# Altium project PowerBoard.PrjPcb (part 2 of 2)
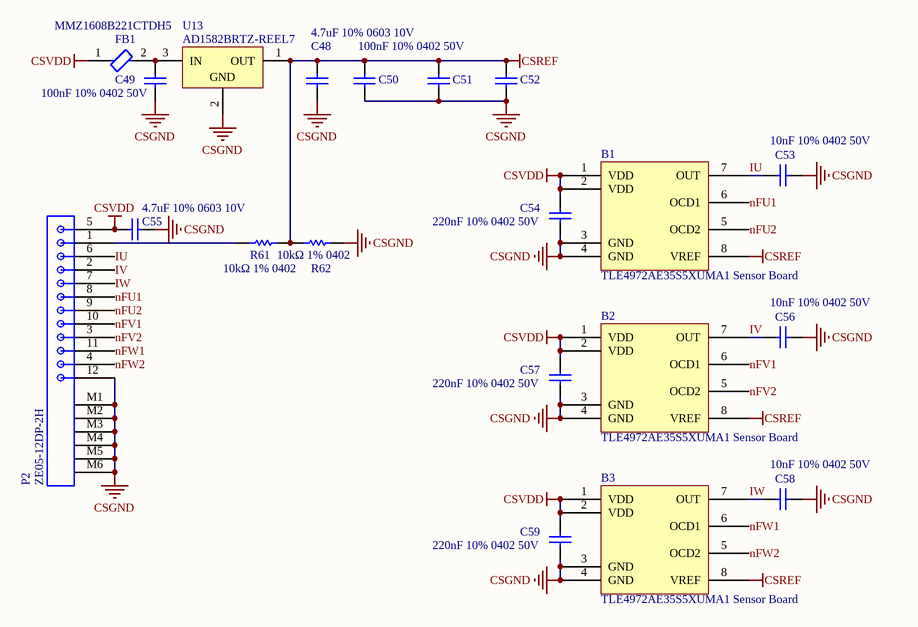
[diagram p14: CurrentSense.SchDoc]

## Nets that join several sheets
+3V3: ControlBoardConnector (8 pins), PowerBridge (R1.1), PBD/HBU/DRVH (C5_PBD_HBU_DRVH.2 U1_PBD_HBU_DRVH.9), PBD/HBU/DRVL (C5_PBD_HBU_DRVL.2 U1_PBD_HBU_DRVL.9), PBD/HBW/DRVH (C5_PBD_HBW_DRVH.2 U1_PBD_HBW_DRVH.9), PBD/HBW/DRVL (C5_PBD_HBW_DRVL.2 U1_PBD_HBW_DRVL.9), IoExpander (6 pins), SpiMux (C24.2 U5.6 U5.16), TempAdc (C25.2 U6.8), PBD/TAD/IS1 (C21_IS1.2 U3_IS1.3), PBD/TAD/IS2 (C21_IS2.2 U3_IS2.3), PBD/TAD/IS3 (C21_IS3.2 U3_IS3.3), PBD/TAD/IS4 (C21_IS4.2 U3_IS4.3), DcLink (5 pins), AndGate (C41.1 U9.5), PBD/HBV/DRVH (C5_PBD_HBV_DRVH.2 U1_PBD_HBV_DRVH.9), PBD/HBV/DRVL (C5_PBD_HBV_DRVL.2 U1_PBD_HBV_DRVL.9), Rectifier (C44.2 R46.1 U10.3)
+24V: ControlBoardConnector (8 pins), PBD/HBU/DRVH/ISU (C15_PBD_HBU_DRVH_ISU.2 C16_PBD_HBU_DRVH_ISU.2 U2_PBD_HBU_DRVH_ISU.6 U2_PBD_HBU_DRVH_ISU.7), PBD/HBU/DRVL/ISU (C15_PBD_HBU_DRVL_ISU.2 C16_PBD_HBU_DRVL_ISU.2 U2_PBD_HBU_DRVL_ISU.6 U2_PBD_HBU_DRVL_ISU.7), PBD/HBW/DRVH/ISU (C15_PBD_HBW_DRVH_ISU.2 C16_PBD_HBW_DRVH_ISU.2 U2_PBD_HBW_DRVH_ISU.6 U2_PBD_HBW_DRVH_ISU.7), PBD/HBW/DRVL/ISU (C15_PBD_HBW_DRVL_ISU.2 C16_PBD_HBW_DRVL_ISU.2 U2_PBD_HBW_DRVL_ISU.6 U2_PBD_HBW_DRVL_ISU.7), PBD/HBV/DRVH/ISU (C15_PBD_HBV_DRVH_ISU.2 C16_PBD_HBV_DRVH_ISU.2 U2_PBD_HBV_DRVH_ISU.6 U2_PBD_HBV_DRVH_ISU.7), PBD/HBV/DRVL/ISU (C15_PBD_HBV_DRVL_ISU.2 C16_PBD_HBV_DRVL_ISU.2 U2_PBD_HBV_DRVL_ISU.6 U2_PBD_HBV_DRVL_ISU.7)
GND: ControlBoardConnector (24 pins), PowerBridge (R2.2 T1.T2 T1.T4 T1.T6), PBD/HBU/DRVH (C5_PBD_HBU_DRVH.1 C6_PBD_HBU_DRVH.1 U1_PBD_HBU_DRVH.1 U1_PBD_HBU_DRVH.18), PBD/HBU/DRVH/ISU (16 pins), PBD/HBU/DRVL (C5_PBD_HBU_DRVL.1 C6_PBD_HBU_DRVL.1 U1_PBD_HBU_DRVL.1 U1_PBD_HBU_DRVL.18), PBD/HBU/DRVL/ISU (16 pins), PBD/HBW/DRVH (C5_PBD_HBW_DRVH.1 C6_PBD_HBW_DRVH.1 U1_PBD_HBW_DRVH.1 U1_PBD_HBW_DRVH.18), PBD/HBW/DRVH/ISU (16 pins), PBD/HBW/DRVL (C5_PBD_HBW_DRVL.1 C6_PBD_HBW_DRVL.1 U1_PBD_HBW_DRVL.1 U1_PBD_HBW_DRVL.18), PBD/HBW/DRVL/ISU (16 pins), IoExpander (C23.1 Q1.2 U4.9 U4.EP), SpiMux (C24.1 U5.8 U5.17), TempAdc (C25.1 U6.3), PBD/TAD/IS1 (5 pins), PBD/TAD/IS2 (5 pins), PBD/TAD/IS3 (5 pins), PBD/TAD/IS4 (5 pins), DcLink (7 pins), AndGate (C41.2 R43.2 R44.2 U9.3), PBD/HBV/DRVH (C5_PBD_HBV_DRVH.1 C6_PBD_HBV_DRVH.1 U1_PBD_HBV_DRVH.1 U1_PBD_HBV_DRVH.18), PBD/HBV/DRVH/ISU (16 pins), PBD/HBV/DRVL (C5_PBD_HBV_DRVL.1 C6_PBD_HBV_DRVL.1 U1_PBD_HBV_DRVL.1 U1_PBD_HBV_DRVL.18), PBD/HBV/DRVL/ISU (16 pins), Rectifier (C44.1 R52.1 U10.4)
N: PowerBridge (T1.N1 T1.N2 T1.N3), DcLink (23 pins), Rectifier (Q5.4)
P: PowerBridge (T1.P1 T1.P2 T1.P3), DcLink (15 pins), Rectifier (6 pins)
BRIDGE_ENA: PowerBridge (BENA.1), PBD/HBU/DRVH/ISU (U2_PBD_HBU_DRVH_ISU.4), PBD/HBU/DRVL/ISU (U2_PBD_HBU_DRVL_ISU.4), PBD/HBW/DRVH/ISU (U2_PBD_HBW_DRVH_ISU.4), PBD/HBW/DRVL/ISU (U2_PBD_HBW_DRVL_ISU.4), AndGate (U9.4), PBD/HBV/DRVH/ISU (U2_PBD_HBV_DRVH_ISU.4), PBD/HBV/DRVL/ISU (U2_PBD_HBV_DRVL_ISU.4)
CTRL_ENA: ControlBoardConnector (P1.9), PowerBridge (CENA.1), AndGate (R43.1 U9.1)
CTRL_nPG: ControlBoardConnector (P1.10), PowerBridge (CPG.1 R1.2), PBD/HBU/DRVH/ISU (U2_PBD_HBU_DRVH_ISU.3), PBD/HBU/DRVL/ISU (U2_PBD_HBU_DRVL_ISU.3), PBD/HBW/DRVH/ISU (U2_PBD_HBW_DRVH_ISU.3), PBD/HBW/DRVL/ISU (U2_PBD_HBW_DRVL_ISU.3), PBD/HBV/DRVH/ISU (U2_PBD_HBV_DRVH_ISU.3), PBD/HBV/DRVL/ISU (U2_PBD_HBV_DRVL_ISU.3)
DRV_COM: PowerBridge (T1.S2.1 T1.S2.2), PBD/HBU/DRVL (11 pins), PBD/HBU/DRVL/ISU (5 pins)
DRV_COM: PowerBridge (T1.S1), PBD/HBU (PHS_HBU.1), PBD/HBU/DRVH (11 pins), PBD/HBU/DRVH/ISU (5 pins)
DRV_COM: PowerBridge (T1.S4.1 T1.S4.2), PBD/HBV/DRVL (11 pins), PBD/HBV/DRVL/ISU (5 pins)
DRV_COM: PowerBridge (T1.S3), PBD/HBV (PHS_HBV.1), PBD/HBV/DRVH (11 pins), PBD/HBV/DRVH/ISU (5 pins)
DRV_COM: PowerBridge (T1.S6.1 T1.S6.2), PBD/HBW/DRVL (11 pins), PBD/HBW/DRVL/ISU (5 pins)
DRV_COM: PowerBridge (T1.S5), PBD/HBW (PHS_HBW.1), PBD/HBW/DRVH (11 pins), PBD/HBW/DRVH/ISU (5 pins)
DRV_VDD_DRVH: PBD/HBU/DRVH (C9_PBD_HBU_DRVH.1 C10_PBD_HBU_DRVH.1 U1_PBD_HBU_DRVH.35), PBD/HBU/DRVH/ISU (6 pins)
DRV_VDD_DRVH: PBD/HBW/DRVH (C9_PBD_HBW_DRVH.1 C10_PBD_HBW_DRVH.1 U1_PBD_HBW_DRVH.35), PBD/HBW/DRVH/ISU (6 pins)
DRV_VDD_DRVH: PBD/HBV/DRVH (C9_PBD_HBV_DRVH.1 C10_PBD_HBV_DRVH.1 U1_PBD_HBV_DRVH.35), PBD/HBV/DRVH/ISU (6 pins)
DRV_VDD_DRVL: PBD/HBU/DRVL (C9_PBD_HBU_DRVL.1 C10_PBD_HBU_DRVL.1 U1_PBD_HBU_DRVL.35), PBD/HBU/DRVL/ISU (6 pins)
DRV_VDD_DRVL: PBD/HBW/DRVL (C9_PBD_HBW_DRVL.1 C10_PBD_HBW_DRVL.1 U1_PBD_HBW_DRVL.35), PBD/HBW/DRVL/ISU (6 pins)
DRV_VDD_DRVL: PBD/HBV/DRVL (C9_PBD_HBV_DRVL.1 C10_PBD_HBV_DRVL.1 U1_PBD_HBV_DRVL.35), PBD/HBV/DRVL/ISU (6 pins)
DRV_VEE_DRVH: PBD/HBU/DRVH (C11_PBD_HBU_DRVH.2 C12_PBD_HBU_DRVH.2 U1_PBD_HBU_DRVH.19 U1_PBD_HBU_DRVH.30), PBD/HBU/DRVH/ISU (20 pins)
DRV_VEE_DRVH: PBD/HBW/DRVH (C11_PBD_HBW_DRVH.2 C12_PBD_HBW_DRVH.2 U1_PBD_HBW_DRVH.19 U1_PBD_HBW_DRVH.30), PBD/HBW/DRVH/ISU (20 pins)
DRV_VEE_DRVH: PBD/HBV/DRVH (C11_PBD_HBV_DRVH.2 C12_PBD_HBV_DRVH.2 U1_PBD_HBV_DRVH.19 U1_PBD_HBV_DRVH.30), PBD/HBV/DRVH/ISU (20 pins)
DRV_VEE_DRVL: PBD/HBU/DRVL (C11_PBD_HBU_DRVL.2 C12_PBD_HBU_DRVL.2 U1_PBD_HBU_DRVL.19 U1_PBD_HBU_DRVL.30), PBD/HBU/DRVL/ISU (20 pins)
DRV_VEE_DRVL: PBD/HBW/DRVL (C11_PBD_HBW_DRVL.2 C12_PBD_HBW_DRVL.2 U1_PBD_HBW_DRVL.19 U1_PBD_HBW_DRVL.30), PBD/HBW/DRVL/ISU (20 pins)
DRV_VEE_DRVL: PBD/HBV/DRVL (C11_PBD_HBV_DRVL.2 C12_PBD_HBV_DRVL.2 U1_PBD_HBV_DRVL.19 U1_PBD_HBV_DRVL.30), PBD/HBV/DRVL/ISU (20 pins)
NetC22_IS1_2: TempAdc (U6.4), PBD/TAD/IS1 (C22_IS1.2 R17_IS1.2 TMPA_IS1.1)
NetC22_IS2_2: TempAdc (U6.5), PBD/TAD/IS2 (C22_IS2.2 R17_IS2.2 TMPA_IS2.1)
NetC22_IS3_2: TempAdc (U6.6), PBD/TAD/IS3 (C22_IS3.2 R17_IS3.2 TMPA_IS3.1)
NetC22_IS4_2: TempAdc (U6.7), PBD/TAD/IS4 (C22_IS4.2 R17_IS4.2 TMPA_IS4.1)
NetC36_1: ControlBoardConnector (P1.48), DcLink (C36.1 R27.1)
NetC36_2: ControlBoardConnector (P1.49), DcLink (C36.2 R30.1)
NetD1_PBD_HBU_DRVH_1: PowerBridge (T1.D1.1), PBD/HBU/DRVH (D1_PBD_HBU_DRVH.1 D2_PBD_HBU_DRVH.1)
NetD1_PBD_HBU_DRVL_1: PowerBridge (T1.D2), PBD/HBU/DRVL (D1_PBD_HBU_DRVL.1 D2_PBD_HBU_DRVL.1)
NetD1_PBD_HBV_DRVH_1: PowerBridge (T1.D3.1), PBD/HBV/DRVH (D1_PBD_HBV_DRVH.1 D2_PBD_HBV_DRVH.1)
NetD1_PBD_HBV_DRVL_1: PowerBridge (T1.D4), PBD/HBV/DRVL (D1_PBD_HBV_DRVL.1 D2_PBD_HBV_DRVL.1)
NetD1_PBD_HBW_DRVH_1: PowerBridge (T1.D5.1), PBD/HBW/DRVH (D1_PBD_HBW_DRVH.1 D2_PBD_HBW_DRVH.1)
NetD1_PBD_HBW_DRVL_1: PowerBridge (T1.D6), PBD/HBW/DRVL (D1_PBD_HBW_DRVL.1 D2_PBD_HBW_DRVL.1)
NetD3_PBD_HBU_DRVH_1: PowerBridge (T1.G1), PBD/HBU (HGAT_HBU.1), PBD/HBU/DRVH (D3_PBD_HBU_DRVH.1 R8_PBD_HBU_DRVH.2 R10_PBD_HBU_DRVH.2 U1_PBD_HBU_DRVH.29)
NetD3_PBD_HBU_DRVL_1: PowerBridge (T1.G2), PBD/HBU (LGAT_HBU.1), PBD/HBU/DRVL (D3_PBD_HBU_DRVL.1 R8_PBD_HBU_DRVL.2 R10_PBD_HBU_DRVL.2 U1_PBD_HBU_DRVL.29)
NetD3_PBD_HBV_DRVH_1: PowerBridge (T1.G3), PBD/HBV (HGAT_HBV.1), PBD/HBV/DRVH (D3_PBD_HBV_DRVH.1 R8_PBD_HBV_DRVH.2 R10_PBD_HBV_DRVH.2 U1_PBD_HBV_DRVH.29)
NetD3_PBD_HBV_DRVL_1: PowerBridge (T1.G4), PBD/HBV (LGAT_HBV.1), PBD/HBV/DRVL (D3_PBD_HBV_DRVL.1 R8_PBD_HBV_DRVL.2 R10_PBD_HBV_DRVL.2 U1_PBD_HBV_DRVL.29)
NetD3_PBD_HBW_DRVH_1: PowerBridge (T1.G5), PBD/HBW (HGAT_HBW.1), PBD/HBW/DRVH (D3_PBD_HBW_DRVH.1 R8_PBD_HBW_DRVH.2 R10_PBD_HBW_DRVH.2 U1_PBD_HBW_DRVH.29)
NetD3_PBD_HBW_DRVL_1: PowerBridge (T1.G6), PBD/HBW (LGAT_HBW.1), PBD/HBW/DRVL (D3_PBD_HBW_DRVL.1 R8_PBD_HBW_DRVL.2 R10_PBD_HBW_DRVL.2 U1_PBD_HBW_DRVL.29)
NetFBON_1: ControlBoardConnector (P1.43), DcLink (FBON.1 U8.1)
NetP1_20: ControlBoardConnector (P1.20), SpiMux (U5.4 U5.5)
NetP1_21: ControlBoardConnector (P1.21), SpiMux (U5.1)
NetP1_22: ControlBoardConnector (P1.22), SpiMux (U5.2)
NetP1_23: ControlBoardConnector (P1.23), SpiMux (U5.3)
NetP1_39: ControlBoardConnector (P1.39), IoExpander (R18.1 U4.22)
NetP1_40: ControlBoardConnector (P1.40), AndGate (R44.1 U9.2)
NetP1_41: ControlBoardConnector (P1.41), IoExpander (Q1.1)
NetP1_42: ControlBoardConnector (P1.42), DcLink (R21.1 U7.14)
NetP1_52: ControlBoardConnector (P1.52), Rectifier (RFON.1 U10.1)
NetP1_53: ControlBoardConnector (P1.53), Rectifier (Q3.4)
NetR2_1: PowerBridge (R2.1), PBD/TAD/IS4 (R16_IS4.2 R17_IS4.1 U3_IS4.1)
NetR16_IS1_2: PowerBridge (T1.T1), PBD/TAD/IS1 (R16_IS1.2 R17_IS1.1 U3_IS1.1)
NetR16_IS2_2: PowerBridge (T1.T3), PBD/TAD/IS2 (R16_IS2.2 R17_IS2.1 U3_IS2.1)
NetR16_IS3_2: PowerBridge (T1.T5), PBD/TAD/IS3 (R16_IS3.2 R17_IS3.1 U3_IS3.1)
PWM_UH: ControlBoardConnector (P1.11), PowerBridge (PUH.1), PBD/HBU/DRVH (U1_PBD_HBU_DRVH.12), PBD/HBU/DRVL (U1_PBD_HBU_DRVL.11)
PWM_UL: ControlBoardConnector (P1.12), PowerBridge (PUL.1), PBD/HBU/DRVH (U1_PBD_HBU_DRVH.11), PBD/HBU/DRVL (U1_PBD_HBU_DRVL.12)
PWM_VH: ControlBoardConnector (P1.13), PowerBridge (PVH.1), PBD/HBV/DRVH (U1_PBD_HBV_DRVH.12), PBD/HBV/DRVL (U1_PBD_HBV_DRVL.11)
PWM_VL: ControlBoardConnector (P1.14), PowerBridge (PVL.1), PBD/HBV/DRVH (U1_PBD_HBV_DRVH.11), PBD/HBV/DRVL (U1_PBD_HBV_DRVL.12)
PWM_WH: ControlBoardConnector (P1.15), PowerBridge (PWH.1), PBD/HBW/DRVH (U1_PBD_HBW_DRVH.12), PBD/HBW/DRVL (U1_PBD_HBW_DRVL.11)
PWM_WL: ControlBoardConnector (P1.16), PowerBridge (PWL.1), PBD/HBW/DRVH (U1_PBD_HBW_DRVH.11), PBD/HBW/DRVL (U1_PBD_HBW_DRVL.12)
U_nFLT1_H: PBD/HBU/DRVH (U1_PBD_HBU_DRVH.7), IoExpander (U4.4)
U_nFLT1_L: PBD/HBU/DRVL (U1_PBD_HBU_DRVL.7), IoExpander (U4.2)
U_nFLT2_H: PBD/HBU/DRVH (U1_PBD_HBU_DRVH.8), IoExpander (U4.3)
U_nFLT2_L: PBD/HBU/DRVL (U1_PBD_HBU_DRVL.8), IoExpander (U4.1)
V_nFLT1_H: IoExpander (U4.5), PBD/HBV/DRVH (U1_PBD_HBV_DRVH.7)
V_nFLT1_L: IoExpander (U4.11), PBD/HBV/DRVL (U1_PBD_HBV_DRVL.7)
V_nFLT2_H: IoExpander (U4.6), PBD/HBV/DRVH (U1_PBD_HBV_DRVH.8)
V_nFLT2_L: IoExpander (U4.10), PBD/HBV/DRVL (U1_PBD_HBV_DRVL.8)
W_nFLT1_H: PBD/HBW/DRVH (U1_PBD_HBW_DRVH.7), IoExpander (U4.13)
W_nFLT1_L: PBD/HBW/DRVL (U1_PBD_HBW_DRVL.7), IoExpander (U4.15)
W_nFLT2_H: PBD/HBW/DRVH (U1_PBD_HBW_DRVH.8), IoExpander (U4.12)
W_nFLT2_L: PBD/HBW/DRVL (U1_PBD_HBW_DRVL.8), IoExpander (U4.14)